# Altium schematic sheet SCH_PowerInOut.SchDoc
size 177 x 127 mm
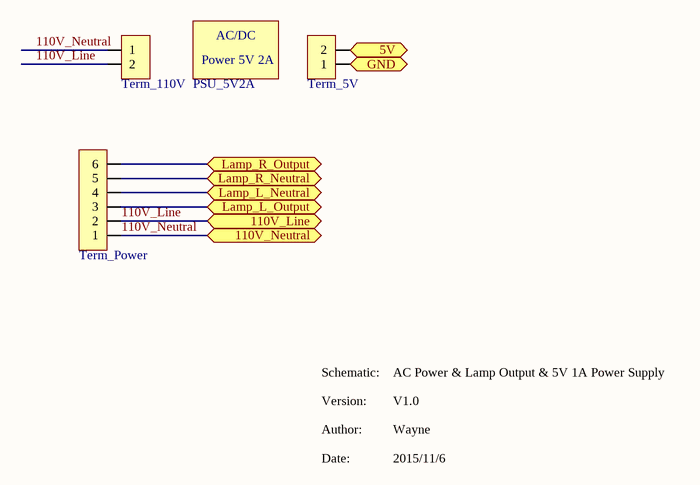
[diagram p0: SCH_PowerInOut.SchDoc]

## Parts
PSU_5V2A  psu  [Power 5V2A Mechanical]  (value not drawn)
Term_5V  Terminal Block Socket 2 way  [TermBlock Socket 2way 5.08]  (value not drawn)
Term_110V  Terminal Block Socket 2 way  [TermBlock Socket 2way 5.08]  (value not drawn)
Term_Power  Terminal Block Socket 6 way  [TermBlock Socket 6way 5.08]  (value not drawn)

## Ports
5V, 110V_Line, 110V_Neutral, GND, Lamp_L_Neutral, Lamp_L_Output, Lamp_R_Neutral, Lamp_R_Output

## Nets
5V: Term_5V.2 ; port 5V
110V_Line: Term_110V.2 Term_Power.2 ; port 110V_Line
110V_Neutral: Term_110V.1 Term_Power.1 ; port 110V_Neutral
GND: Term_5V.1 ; port GND
Lamp_L_Neutral: Term_Power.4 ; port Lamp_L_Neutral
Lamp_L_Output: Term_Power.3 ; port Lamp_L_Output
Lamp_R_Neutral: Term_Power.5 ; port Lamp_R_Neutral
Lamp_R_Output: Term_Power.6 ; port Lamp_R_Output

## Notes on the sheet
- AC Power & Lamp Output & 5V 1A Power Supply
- Schematic:
  Version:
  Author:
  Date:
- Wayne
- V1.0
- 2015/11/6
- (in symbol Psu 5V2A) AC/DC; Power 5V 2A

## Library data of the parts
PSU_5V2A = Psu 5V2A: PSU AC DC 5V 2A Mechanical
Term_5V Term_110V = Term Block Socket 2 way: Terminal Block Socket 2 way 5.08
Term_Power = Term Block Socket 6 way: Terminal Block Socket 6 way 5.08